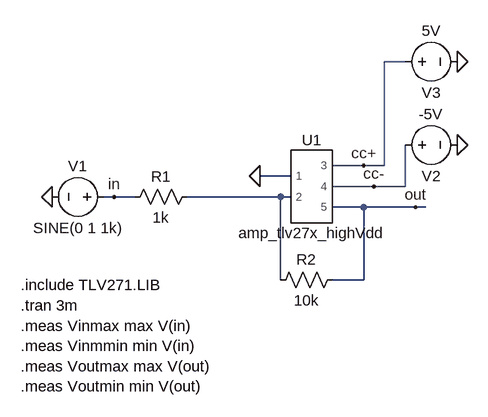
[diagram p0: schematic Exercise6_a.asc]
Exercise6_a.asc, the LTspice schematic file:
Version 4.1
SHEET 1 880 680
WIRE 208 -80 176 -80
WIRE 144 80 96 80
WIRE 176 80 176 -80
WIRE 176 80 144 80
WIRE 32 96 -16 96
WIRE 160 112 96 112
WIRE 208 112 208 48
WIRE 208 112 160 112
WIRE -240 128 -256 128
WIRE -208 128 -240 128
WIRE 16 128 -128 128
WIRE 32 128 16 128
WIRE 144 144 96 144
WIRE 224 144 144 144
WIRE 240 144 224 144
WIRE 16 256 16 128
WIRE 144 256 144 144
WIRE 144 256 96 256
FLAG -16 96 0
FLAG -336 128 0
FLAG 288 -80 0
FLAG 288 48 0
FLAG 144 80 cc+
FLAG 160 112 cc-
FLAG 224 144 out
FLAG -240 128 in
SYMBOL amp_tlv27x_highVdd1 64 112 R0
SYMATTR InstName U1
SYMBOL res -112 112 R90
WINDOW 0 0 56 VBottom 2
WINDOW 3 32 56 VTop 2
SYMATTR InstName R1
SYMATTR Value 1k
SYMBOL res 112 240 R90
WINDOW 0 0 56 VBottom 2
WINDOW 3 32 56 VTop 2
SYMATTR InstName R2
SYMATTR Value 10k
SYMBOL voltage -240 128 R90
WINDOW 0 -32 56 VBottom 2
WINDOW 3 32 56 VTop 2
WINDOW 123 0 0 Left 0
WINDOW 39 0 0 Left 0
SYMATTR InstName V1
SYMATTR Value SINE(0 1 1k)
SYMBOL voltage 192 48 R270
WINDOW 0 -32 56 VBottom 2
WINDOW 3 32 56 VTop 2
WINDOW 123 0 0 Left 0
WINDOW 39 0 0 Left 0
SYMATTR InstName V2
SYMATTR Value -5V
SYMBOL voltage 192 -80 R270
WINDOW 0 -32 56 VBottom 2
WINDOW 3 32 56 VTop 2
WINDOW 123 0 0 Left 0
WINDOW 39 0 0 Left 0
SYMATTR InstName V3
SYMATTR Value 5V
TEXT -384 264 Left 2 !.include TLV271.LIB\n.tran 3m\n.meas Vinmax max V(in)\n.meas Vinmmin min V(in)\n.meas Voutmax max V(out)\n.meas Voutmin min V(out)

The netlist it stands for:
* Exercise6_a.asc
X§U1 0 N001 cc+ cc- out amp_tlv27x_highVdd  ; pins 1 2 3 4 5
R1 N001 in 1k
R2 out N001 10k
V1 in 0 SINE(0 1 1k)
V2 cc- 0 -5V
V3 cc+ 0 5V
.include TLV271.LIB
.tran 3m
.meas Vinmax max V(in)
.meas Vinmmin min V(in)
.meas Voutmax max V(out)
.meas Voutmin min V(out)
.lib TLV271.LIB
.backanno
.end